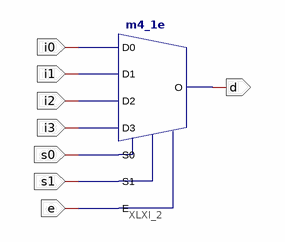
[diagram p0: schematic sheet 1]
// Xilinx ISE schematic data_bus.sch (artix7) as structural Verilog: 1 symbols, 8 ports
module data_bus (
  input  i0,
  input  i1,
  input  i2,
  input  i3,
  input  s0,
  input  s1,
  input  e,
  output d
);

  m4_1e XLXI_2 (.D0(i0), .D1(i1), .D2(i2), .D3(i3), .E(e), .S0(s0), .S1(s1), .O(d));
endmodule
